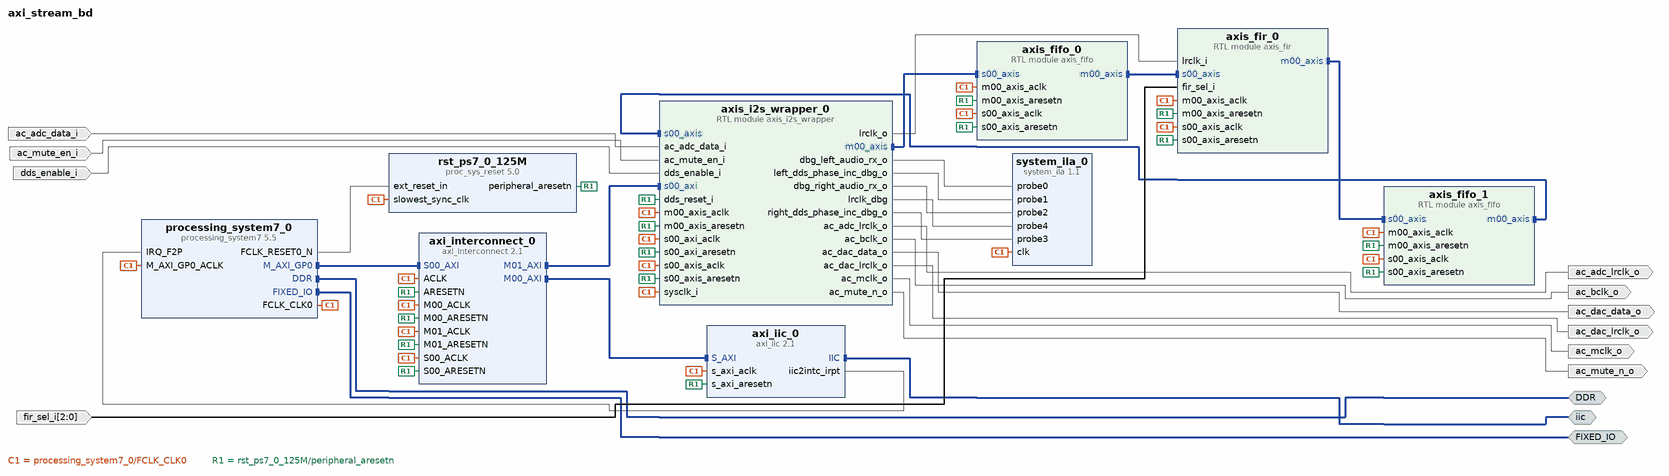
[diagram p0: block diagram of the top level]
# Vivado block design axi_stream_bd, xc7z010clg400-1, Vivado 2021.2
create_bd_design axi_stream_bd

create_bd_intf_port -mode Master -vlnv xilinx.com:interface:ddrx_rtl:1.0 DDR
create_bd_intf_port -mode Master -vlnv xilinx.com:display_processing_system7:fixedio_rtl:1.0 FIXED_IO
create_bd_intf_port -mode Master -vlnv xilinx.com:interface:iic_rtl:1.0 iic
create_bd_port -dir O ac_dac_lrclk_o
create_bd_port -dir O ac_dac_data_o
create_bd_port -dir O ac_bclk_o
create_bd_port -dir O ac_mute_n_o
create_bd_port -dir O ac_mclk_o
create_bd_port -dir O ac_adc_lrclk_o
create_bd_port -dir I -from 2 -to 0 fir_sel_i
create_bd_port -dir I ac_mute_en_i
create_bd_port -dir I ac_adc_data_i
create_bd_port -dir I dds_enable_i

create_bd_cell -type ip -vlnv xilinx.com:ip:processing_system7:5.5 processing_system7_0
set_property -dict [list \
  CONFIG.PCW_APU_PERIPHERAL_FREQMHZ 667 \
  CONFIG.PCW_ENET0_ENET0_IO {MIO 16 .. 27} \
  CONFIG.PCW_ENET0_GRP_MDIO_ENABLE 1 \
  CONFIG.PCW_ENET0_GRP_MDIO_IO {MIO 52 .. 53} \
  CONFIG.PCW_ENET0_PERIPHERAL_ENABLE 1 \
  CONFIG.PCW_ENET0_RESET_ENABLE 0 \
  CONFIG.PCW_ENET_RESET_ENABLE 1 \
  CONFIG.PCW_ENET_RESET_SELECT {Share reset pin} \
  CONFIG.PCW_FPGA0_PERIPHERAL_FREQMHZ 125 \
  CONFIG.PCW_GPIO_MIO_GPIO_ENABLE 1 \
  CONFIG.PCW_GPIO_MIO_GPIO_IO MIO \
  CONFIG.PCW_I2C_RESET_ENABLE 1 \
  CONFIG.PCW_IRQ_F2P_INTR 1 \
  CONFIG.PCW_PRESET_BANK1_VOLTAGE {LVCMOS 1.8V} \
  CONFIG.PCW_QSPI_GRP_FBCLK_ENABLE 1 \
  CONFIG.PCW_QSPI_GRP_FBCLK_IO {MIO 8} \
  CONFIG.PCW_QSPI_GRP_SINGLE_SS_ENABLE 1 \
  CONFIG.PCW_QSPI_GRP_SINGLE_SS_IO {MIO 1 .. 6} \
  CONFIG.PCW_QSPI_PERIPHERAL_ENABLE 1 \
  CONFIG.PCW_QSPI_QSPI_IO {MIO 1 .. 6} \
  CONFIG.PCW_SD0_GRP_CD_ENABLE 1 \
  CONFIG.PCW_SD0_GRP_CD_IO {MIO 47} \
  CONFIG.PCW_SD0_GRP_WP_ENABLE 0 \
  CONFIG.PCW_SD0_PERIPHERAL_ENABLE 1 \
  CONFIG.PCW_SD0_SD0_IO {MIO 40 .. 45} \
  CONFIG.PCW_SDIO_PERIPHERAL_FREQMHZ 50 \
  CONFIG.PCW_SINGLE_QSPI_DATA_MODE x4 \
  CONFIG.PCW_UART1_PERIPHERAL_ENABLE 1 \
  CONFIG.PCW_UART1_UART1_IO {MIO 48 .. 49} \
  CONFIG.PCW_UART_PERIPHERAL_FREQMHZ 100 \
  CONFIG.PCW_UIPARAM_DDR_FREQ_MHZ 533.333333 \
  CONFIG.PCW_UIPARAM_DDR_MEMORY_TYPE {DDR 3 (Low Voltage)} \
  CONFIG.PCW_UIPARAM_DDR_PARTNO {MT41K256M16 RE-125} \
  CONFIG.PCW_USB0_PERIPHERAL_ENABLE 1 \
  CONFIG.PCW_USB0_RESET_ENABLE 1 \
  CONFIG.PCW_USB0_RESET_IO {MIO 46} \
  CONFIG.PCW_USB0_USB0_IO {MIO 28 .. 39} \
  CONFIG.PCW_USB_RESET_ENABLE 1 \
  CONFIG.PCW_USB_RESET_SELECT {Share reset pin} \
  CONFIG.PCW_USE_FABRIC_INTERRUPT 1 \
] [get_bd_cells processing_system7_0]
# 296 more settings of processing_system7_0 are not shown: defaults, MIO pin electricals, DDR timing, and values the tool derives
create_bd_cell -type ip -vlnv xilinx.com:ip:axi_iic:2.1 axi_iic_0
set_property -dict {CONFIG.AXI_ACLK_FREQ_MHZ 100.0} [get_bd_cells axi_iic_0]
create_bd_cell -type module -reference axis_fifo axis_fifo_0
create_bd_cell -type module -reference axis_fifo axis_fifo_1
create_bd_cell -type ip -vlnv xilinx.com:ip:axi_interconnect:2.1 axi_interconnect_0
create_bd_cell -type ip -vlnv xilinx.com:ip:proc_sys_reset:5.0 rst_ps7_0_125M
create_bd_cell -type ip -vlnv xilinx.com:ip:system_ila:1.1 system_ila_0
set_property -dict {CONFIG.C_MON_TYPE NATIVE CONFIG.C_NUM_OF_PROBES 5} [get_bd_cells system_ila_0]
create_bd_cell -type module -reference axis_i2s_wrapper axis_i2s_wrapper_0
create_bd_cell -type module -reference axis_fir axis_fir_0

# ---- connections ----

connect_bd_intf_net [get_bd_intf_ports iic] [get_bd_intf_pins axi_iic_0/IIC]
connect_bd_intf_net [get_bd_intf_pins axi_interconnect_0/M00_AXI] [get_bd_intf_pins axi_iic_0/S_AXI]
connect_bd_intf_net [get_bd_intf_pins axi_interconnect_0/M01_AXI] [get_bd_intf_pins axis_i2s_wrapper_0/s00_axi]
connect_bd_intf_net [get_bd_intf_pins axis_fifo_0/m00_axis] [get_bd_intf_pins axis_fir_0/s00_axis]
connect_bd_intf_net [get_bd_intf_pins axis_fifo_1/m00_axis] [get_bd_intf_pins axis_i2s_wrapper_0/s00_axis]
connect_bd_intf_net [get_bd_intf_pins axis_fir_0/m00_axis] [get_bd_intf_pins axis_fifo_1/s00_axis]
connect_bd_intf_net [get_bd_intf_pins axis_i2s_wrapper_0/m00_axis] [get_bd_intf_pins axis_fifo_0/s00_axis]
connect_bd_intf_net [get_bd_intf_ports DDR] [get_bd_intf_pins processing_system7_0/DDR]
connect_bd_intf_net [get_bd_intf_ports FIXED_IO] [get_bd_intf_pins processing_system7_0/FIXED_IO]
connect_bd_intf_net [get_bd_intf_pins processing_system7_0/M_AXI_GP0] [get_bd_intf_pins axi_interconnect_0/S00_AXI]
connect_bd_net -net ac_adc_data_i_0_1 [get_bd_ports ac_adc_data_i] [get_bd_pins axis_i2s_wrapper_0/ac_adc_data_i]
connect_bd_net -net ac_mute_en_i_0_1 [get_bd_ports ac_mute_en_i] [get_bd_pins axis_i2s_wrapper_0/ac_mute_en_i]
connect_bd_net [get_bd_pins axi_iic_0/iic2intc_irpt] [get_bd_pins processing_system7_0/IRQ_F2P]
connect_bd_net [get_bd_pins axis_i2s_wrapper_0/ac_adc_lrclk_o] [get_bd_ports ac_adc_lrclk_o]
connect_bd_net [get_bd_pins axis_i2s_wrapper_0/ac_bclk_o] [get_bd_ports ac_bclk_o]
connect_bd_net [get_bd_pins axis_i2s_wrapper_0/ac_dac_data_o] [get_bd_ports ac_dac_data_o]
connect_bd_net [get_bd_pins axis_i2s_wrapper_0/ac_dac_lrclk_o] [get_bd_ports ac_dac_lrclk_o]
connect_bd_net [get_bd_pins axis_i2s_wrapper_0/ac_mclk_o] [get_bd_ports ac_mclk_o]
connect_bd_net [get_bd_pins axis_i2s_wrapper_0/ac_mute_n_o] [get_bd_ports ac_mute_n_o]
connect_bd_net [get_bd_pins axis_i2s_wrapper_0/dbg_left_audio_rx_o] [get_bd_pins system_ila_0/probe0]
connect_bd_net -net axis_i2s_wrapper_0_dbg_left_audio_tx_o [get_bd_pins axis_i2s_wrapper_0/left_dds_phase_inc_dbg_o] [get_bd_pins system_ila_0/probe1]
connect_bd_net [get_bd_pins axis_i2s_wrapper_0/dbg_right_audio_rx_o] [get_bd_pins system_ila_0/probe2]
connect_bd_net [get_bd_pins axis_i2s_wrapper_0/lrclk_dbg] [get_bd_pins system_ila_0/probe4]
connect_bd_net [get_bd_pins axis_i2s_wrapper_0/lrclk_o] [get_bd_pins axis_fir_0/lrclk_i]
connect_bd_net [get_bd_pins axis_i2s_wrapper_0/right_dds_phase_inc_dbg_o] [get_bd_pins system_ila_0/probe3]
connect_bd_net -net dds_enable_i_0_1 [get_bd_ports dds_enable_i] [get_bd_pins axis_i2s_wrapper_0/dds_enable_i]
connect_bd_net -net fir_sel_i_0_1 [get_bd_ports fir_sel_i] [get_bd_pins axis_fir_0/fir_sel_i]
connect_bd_net [get_bd_pins processing_system7_0/FCLK_CLK0] \
  [get_bd_pins processing_system7_0/M_AXI_GP0_ACLK] [get_bd_pins axis_fifo_0/s00_axis_aclk] \
  [get_bd_pins axis_fifo_0/m00_axis_aclk] [get_bd_pins axis_fifo_1/s00_axis_aclk] [get_bd_pins axis_fifo_1/m00_axis_aclk] \
  [get_bd_pins axi_interconnect_0/S00_ACLK] [get_bd_pins rst_ps7_0_125M/slowest_sync_clk] [get_bd_pins axi_iic_0/s_axi_aclk] \
  [get_bd_pins axi_interconnect_0/M00_ACLK] [get_bd_pins axi_interconnect_0/ACLK] [get_bd_pins axi_interconnect_0/M01_ACLK] \
  [get_bd_pins system_ila_0/clk] [get_bd_pins axis_i2s_wrapper_0/sysclk_i] [get_bd_pins axis_i2s_wrapper_0/s00_axis_aclk] \
  [get_bd_pins axis_i2s_wrapper_0/m00_axis_aclk] [get_bd_pins axis_i2s_wrapper_0/s00_axi_aclk] \
  [get_bd_pins axis_fir_0/s00_axis_aclk] [get_bd_pins axis_fir_0/m00_axis_aclk]
connect_bd_net [get_bd_pins processing_system7_0/FCLK_RESET0_N] [get_bd_pins rst_ps7_0_125M/ext_reset_in]
connect_bd_net [get_bd_pins rst_ps7_0_125M/peripheral_aresetn] \
  [get_bd_pins axi_interconnect_0/S00_ARESETN] [get_bd_pins axi_iic_0/s_axi_aresetn] \
  [get_bd_pins axis_fifo_0/s00_axis_aresetn] [get_bd_pins axis_fifo_0/m00_axis_aresetn] \
  [get_bd_pins axis_fifo_1/s00_axis_aresetn] [get_bd_pins axis_fifo_1/m00_axis_aresetn] \
  [get_bd_pins axi_interconnect_0/M00_ARESETN] [get_bd_pins axi_interconnect_0/ARESETN] \
  [get_bd_pins axi_interconnect_0/M01_ARESETN] [get_bd_pins axis_i2s_wrapper_0/dds_reset_i] \
  [get_bd_pins axis_i2s_wrapper_0/s00_axis_aresetn] [get_bd_pins axis_i2s_wrapper_0/m00_axis_aresetn] \
  [get_bd_pins axis_i2s_wrapper_0/s00_axi_aresetn] [get_bd_pins axis_fir_0/s00_axis_aresetn] \
  [get_bd_pins axis_fir_0/m00_axis_aresetn]

# ---- address map ----
assign_bd_address -offset 0x41600000 -range 64K -target_address_space [get_bd_addr_spaces processing_system7_0/Data] [get_bd_addr_segs axi_iic_0/S_AXI/Reg]
assign_bd_address -offset 0x43C00000 -range 64K -target_address_space [get_bd_addr_spaces processing_system7_0/Data] [get_bd_addr_segs axis_i2s_wrapper_0/s00_axi/reg0]

validate_bd_design
save_bd_design
